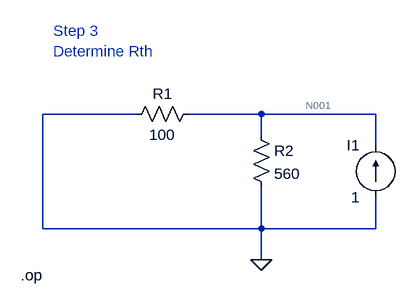
[diagram p0: schematic EEE_1_3.asc]
EEE_1_3.asc, the LTspice schematic file:
Version 4
SHEET 1 880 680
WIRE 128 64 -16 64
WIRE 320 64 208 64
WIRE 496 64 320 64
WIRE 320 96 320 64
WIRE 496 112 496 64
WIRE -16 240 -16 64
WIRE 320 240 320 176
WIRE 320 240 -16 240
WIRE 496 240 496 192
WIRE 496 240 320 240
WIRE 320 288 320 240
FLAG 320 288 0
SYMBOL res 224 48 R90
WINDOW 0 0 56 VBottom 2
WINDOW 3 32 56 VTop 2
SYMATTR InstName R1
SYMATTR Value 100
SYMBOL res 304 80 R0
SYMATTR InstName R2
SYMATTR Value 560
SYMBOL current 496 192 R180
WINDOW 0 24 80 Left 2
WINDOW 3 24 0 Left 2
SYMATTR InstName I1
SYMATTR Value 1
TEXT 0 -64 Left 2 ;Step 3\nDetermine Rth
TEXT -50 312 Left 2 !.op

The netlist it stands for:
* EEE_1_3.asc
R1 N001 0 100
R2 N001 0 560
I1 0 N001 1
* Step 3
* Determine Rth
.op
.backanno
.end

* Results of the author's LTspice run, read from the files saved beside the schematic
* Operating Point:
*   V(n001) = 84.85 V
*   I(I1) = 1 A
*   I(R2) = 151.5 mA
*   I(R1) = 848.5 mA